# EAGLE design fpga (EAGLE 6.4)
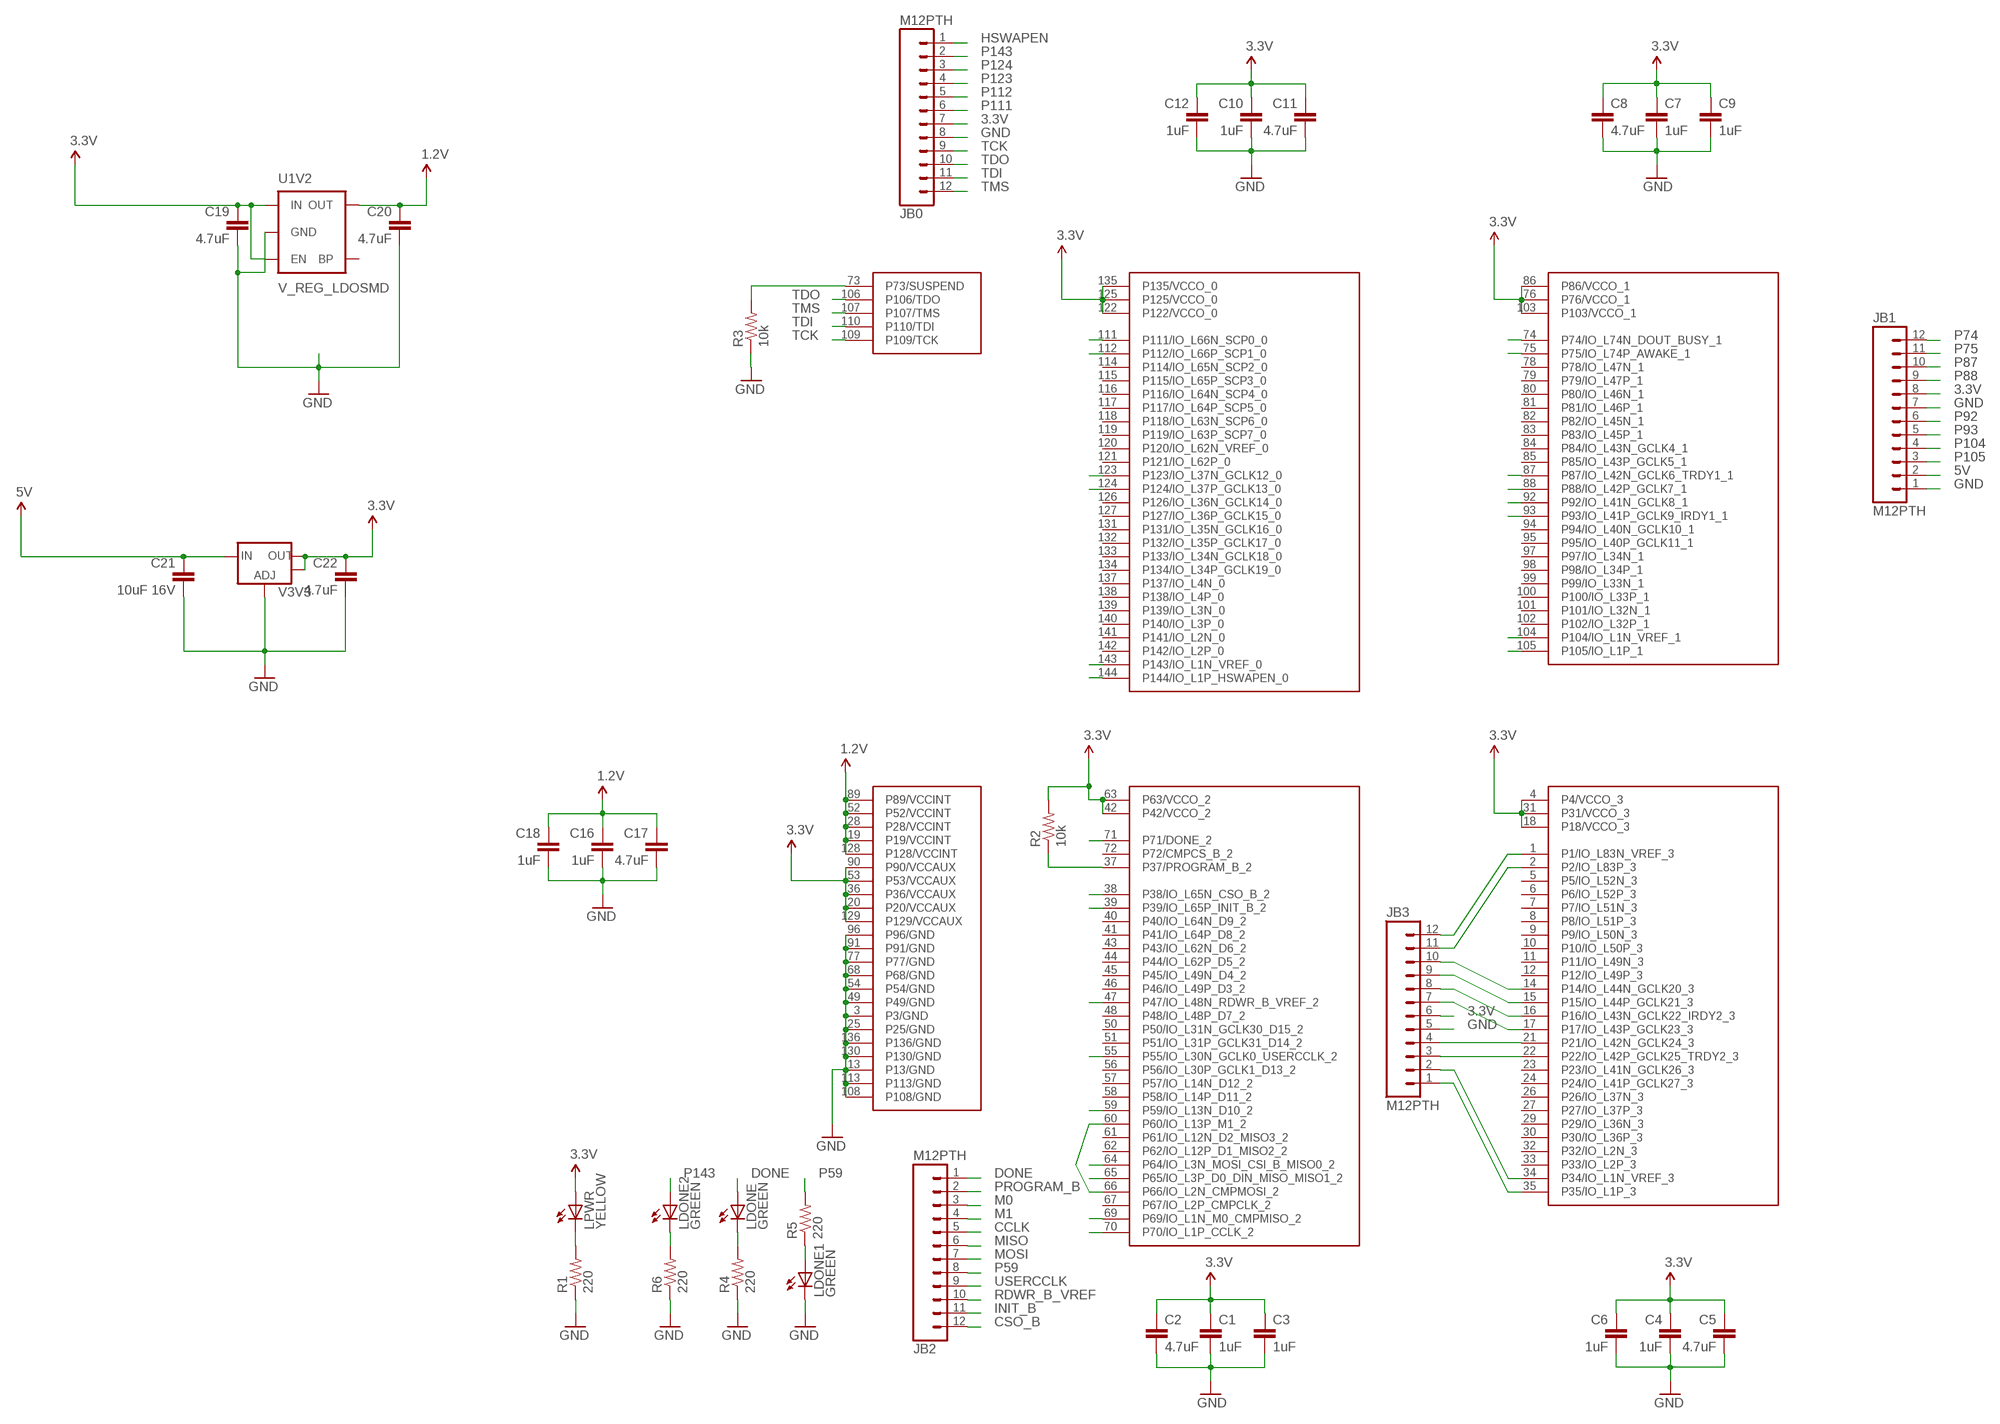
[diagram p0: schematic, sheet 1]

## Parts
C1  1uF  CAP0402-CAP  [0402-CAP]
C2  4.7uF  CAP0805  [0805]
C3  1uF  CAP0402-CAP  [0402-CAP]
C4  1uF  CAP0402-CAP  [0402-CAP]
C5  4.7uF  CAP0805  [0805]
C6  1uF  CAP0402-CAP  [0402-CAP]
C7  1uF  CAP0402-CAP  [0402-CAP]
C8  4.7uF  CAP0805  [0805]
C9  1uF  CAP0402-CAP  [0402-CAP]
C10  1uF  CAP0402-CAP  [0402-CAP]
C11  4.7uF  CAP0805  [0805]
C12  1uF  CAP0402-CAP  [0402-CAP]
C16  1uF  CAP0402-CAP  [0402-CAP]
C17  4.7uF  CAP0805  [0805]
C18  1uF  CAP0402-CAP  [0402-CAP]
C19  4.7uF  CAP0805  [0805]
C20  4.7uF  CAP0805  [0805]
C21  10uF 16V  CAP0805  [0805]
C22  4.7uF  CAP0805  [0805]
JB0  M12PTH  [1X12]
JB1  M12PTH  [1X12]
JB2  M12PTH  [1X12]
JB3  M12PTH  [1X12]
LDONE  GREEN  LED0603  [0603_LED]
LDONE1  GREEN  LED0603  [0603_LED]
LDONE2  GREEN  LED0603  [0603_LED]
LPWR  YELLOW  LED0603  [0603_LED]
R1  220  RESISTOR0603  [0603-RES]
R2  10k  RESISTOR0603  [0603-RES]
R3  10k  RESISTOR0603  [0603-RES]
R4  220  RESISTOR0603  [0603-RES]
R5  220  RESISTOR0603  [0603-RES]
R6  220  RESISTOR0603  [0603-RES]
U1V2  V_REG_LDOSMD  [SOT23-5]
U$1  XC6SLX-TQ144  [XILNX_TQ144]
V3V3  V_REG_LM1117SOT223  [SOT223]

## Nets
1.2V: C16.1 C17.1 C18.1 C20.1 U1V2.5(OUT) U$1.19(P19/VCCINT) U$1.28(P28/VCCINT) U$1.52(P52/VCCINT) U$1.89(P89/VCCINT) U$1.128(P128/VCCINT)
3.3V: C1.1 C2.1 C3.1 C4.1 C5.1 C6.1 C7.1 C8.1 C9.1 C10.1 C11.1 C12.1 C19.1 C22.1 JB0.7 JB1.8 JB3.6 LPWR.A R2.2 U1V2.1(IN) U1V2.3(EN) U$1.4(P4/VCCO_3) U$1.18(P18/VCCO_3) U$1.20(P20/VCCAUX) U$1.31(P31/VCCO_3) U$1.36(P36/VCCAUX) U$1.42(P42/VCCO_2) U$1.53(P53/VCCAUX) U$1.63(P63/VCCO_2) U$1.76(P76/VCCO_1) U$1.86(P86/VCCO_1) U$1.90(P90/VCCAUX) U$1.103(P103/VCCO_1) U$1.122(P122/VCCO_0) U$1.125(P125/VCCO_0) U$1.129(P129/VCCAUX) U$1.135(P135/VCCO_0) V3V3.2(OUT) V3V3.4(OUT)
5V: C21.1 JB1.2 V3V3.3(IN)
CCLK: JB2.5 U$1.70(P70/IO_L1P_CCLK_2)
CSO_B: JB2.12 U$1.38(P38/IO_L65N_CSO_B_2)
DONE: JB2.1 LDONE.A U$1.71(P71/DONE_2)
GND: C1.2 C2.2 C3.2 C4.2 C5.2 C6.2 C7.2 C8.2 C9.2 C10.2 C11.2 C12.2 C16.2 C17.2 C18.2 C19.2 C20.2 C21.2 C22.2 JB0.8 JB1.1 JB1.7 JB3.5 LDONE1.C R1.1 R3.1 R4.1 R6.1 U1V2.2(GND) U$1.3(P3/GND) U$1.13(P13/GND) U$1.25(P25/GND) U$1.49(P49/GND) U$1.54(P54/GND) U$1.68(P68/GND) U$1.77(P77/GND) U$1.91(P91/GND) U$1.96(P96/GND) U$1.108(P108/GND) U$1.113(P113/GND) U$1.130(P130/GND) U$1.136(P136/GND) V3V3.1(ADJ)
HSWAPEN: JB0.1 U$1.144(P144/IO_L1P_HSWAPEN_0)
INIT_B: JB2.11 U$1.39(P39/IO_L65P_INIT_B_2)
M0: JB2.3 U$1.69(P69/IO_L1N_M0_CMPMISO_2)
M1: JB2.4 U$1.60(P60/IO_L13P_M1_2) U$1.66(P66/IO_L2N_CMPMOSI_2)
MISO: JB2.6 U$1.65(P65/IO_L3P_D0_DIN_MISO_MISO1_2)
MOSI: JB2.7 U$1.64(P64/IO_L3N_MOSI_CSI_B_MISO0_2)
N$1: LDONE1.A R5.1
N$2: LPWR.C R1.2
N$3: LDONE.C R4.2
N$4: LDONE2.C R6.2
N$8: R3.2 U$1.73(P73/SUSPEND)
P1: JB3.12 U$1.1(P1/IO_L83N_VREF_3)
P2: JB3.11 U$1.2(P2/IO_L83P_3)
P14: JB3.10 U$1.14(P14/IO_L44N_GCLK20_3)
P15: JB3.9 U$1.15(P15/IO_L44P_GCLK21_3)
P16: JB3.8 U$1.16(P16/IO_L43N_GCLK22_IRDY2_3)
P17: JB3.7 U$1.17(P17/IO_L43P_GCLK23_3)
P21: JB3.4 U$1.21(P21/IO_L42N_GCLK24_3)
P22: JB3.3 U$1.22(P22/IO_L42P_GCLK25_TRDY2_3)
P34: JB3.2 U$1.34(P34/IO_L1N_VREF_3)
P35: JB3.1 U$1.35(P35/IO_L1P_3)
P59: JB2.8 R5.2 U$1.59(P59/IO_L13N_D10_2)
P74: JB1.12 U$1.74(P74/IO_L74N_DOUT_BUSY_1)
P75: JB1.11 U$1.75(P75/IO_L74P_AWAKE_1)
P87: JB1.10 U$1.87(P87/IO_L42N_GCLK6_TRDY1_1)
P88: JB1.9 U$1.88(P88/IO_L42P_GCLK7_1)
P92: JB1.6 U$1.92(P92/IO_L41N_GCLK8_1)
P93: JB1.5 U$1.93(P93/IO_L41P_GCLK9_IRDY1_1)
P104: JB1.4 U$1.104(P104/IO_L1N_VREF_1)
P105: JB1.3 U$1.105(P105/IO_L1P_1)
P111: JB0.6 U$1.111(P111/IO_L66N_SCP0_0)
P112: JB0.5 U$1.112(P112/IO_L66P_SCP1_0)
P123: JB0.4 U$1.123(P123/IO_L37N_GCLK12_0)
P124: JB0.3 U$1.124(P124/IO_L37P_GCLK13_0)
P143: JB0.2 LDONE2.A U$1.143(P143/IO_L1N_VREF_0)
PROGRAM_B: JB2.2 R2.1 U$1.37(P37/PROGRAM_B_2)
RDWR_B_VREF: JB2.10 U$1.47(P47/IO_L48N_RDWR_B_VREF_2)
TCK: JB0.9 U$1.109(P109/TCK)
TDI: JB0.11 U$1.110(P110/TDI)
TDO: JB0.10 U$1.106(P106/TDO)
TMS: JB0.12 U$1.107(P107/TMS)
USERCCLK: JB2.9 U$1.55(P55/IO_L30N_GCLK0_USERCCLK_2)
Unconnected: U1V2.4(BP) U$1.5(P5/IO_L52N_3) U$1.6(P6/IO_L52P_3) U$1.7(P7/IO_L51N_3) U$1.8(P8/IO_L51P_3) U$1.9(P9/IO_L50N_3) U$1.10(P10/IO_L50P_3) U$1.11(P11/IO_L49N_3) U$1.12(P12/IO_L49P_3) U$1.23(P23/IO_L41N_GCLK26_3) U$1.24(P24/IO_L41P_GCLK27_3) U$1.26(P26/IO_L37N_3) U$1.27(P27/IO_L37P_3) U$1.29(P29/IO_L36N_3) U$1.30(P30/IO_L36P_3) U$1.32(P32/IO_L2N_3) U$1.33(P33/IO_L2P_3) U$1.40(P40/IO_L64N_D9_2) U$1.41(P41/IO_L64P_D8_2) U$1.43(P43/IO_L62N_D6_2) U$1.44(P44/IO_L62P_D5_2) U$1.45(P45/IO_L49N_D4_2) U$1.46(P46/IO_L49P_D3_2) U$1.48(P48/IO_L48P_D7_2) U$1.50(P50/IO_L31N_GCLK30_D15_2) U$1.51(P51/IO_L31P_GCLK31_D14_2) U$1.56(P56/IO_L30P_GCLK1_D13_2) U$1.57(P57/IO_L14N_D12_2) U$1.58(P58/IO_L14P_D11_2) U$1.61(P61/IO_L12N_D2_MISO3_2) U$1.62(P62/IO_L12P_D1_MISO2_2) U$1.67(P67/IO_L2P_CMPCLK_2) U$1.72(P72/CMPCS_B_2) U$1.78(P78/IO_L47N_1) U$1.79(P79/IO_L47P_1) U$1.80(P80/IO_L46N_1) U$1.81(P81/IO_L46P_1) U$1.82(P82/IO_L45N_1) U$1.83(P83/IO_L45P_1) U$1.84(P84/IO_L43N_GCLK4_1) U$1.85(P85/IO_L43P_GCLK5_1) U$1.94(P94/IO_L40N_GCLK10_1) U$1.95(P95/IO_L40P_GCLK11_1) U$1.97(P97/IO_L34N_1) U$1.98(P98/IO_L34P_1) U$1.99(P99/IO_L33N_1) U$1.100(P100/IO_L33P_1) U$1.101(P101/IO_L32N_1) U$1.102(P102/IO_L32P_1) U$1.114(P114/IO_L65N_SCP2_0) U$1.115(P115/IO_L65P_SCP3_0) U$1.116(P116/IO_L64N_SCP4_0) U$1.117(P117/IO_L64P_SCP5_0) U$1.118(P118/IO_L63N_SCP6_0) U$1.119(P119/IO_L63P_SCP7_0) U$1.120(P120/IO_L62N_VREF_0) U$1.121(P121/IO_L62P_0) U$1.126(P126/IO_L36N_GCLK14_0) U$1.127(P127/IO_L36P_GCLK15_0) U$1.131(P131/IO_L35N_GCLK16_0) U$1.132(P132/IO_L35P_GCLK17_0) U$1.133(P133/IO_L34N_GCLK18_0) U$1.134(P134/IO_L34P_GCLK19_0) U$1.137(P137/IO_L4N_0) U$1.138(P138/IO_L4P_0) U$1.139(P139/IO_L3N_0) U$1.140(P140/IO_L3P_0) U$1.141(P141/IO_L2N_0) U$1.142(P142/IO_L2P_0)

## Library data of the parts
C1 C3 C4 C6 C7 C9 C10 C12 C16 C18 = SparkFun-Capacitors:CAP: Capacitor Standard 0603 ceramic capacitor, and 0.1" leaded capacitor.
C2 C5 C8 C11 C17 C19-C22 = kmod:CAP: Capacitor Standard 0603 ceramic capacitor, and 0.1" leaded capacitor.
JB0 JB1-JB3 = SparkFun-Connectors:M12: Header 12 Standard 12-pin 0.1" header. Use with straight break away headers (SKU : PRT-00116), right angle break away headers (PRT-00553), swiss pins (PRT-00743), machine pins (PRT-00117), and female headers (PRT-00115).
LDONE LDONE1 LDONE2 LPWR = kmod:LED
R1-R6 = kmod:RESISTOR: Resistor Basic schematic elements and footprints for 0603, 1206, and PTH resistors.
U1V2 = SparkFun-PowerIC:V_REG_LDO: Voltage Regulator LDO Standard 150mA LDO voltage regulator in SOT-23 layout. Micrel part MIC5205. BP (by-pass) pin is used to lower output noise with 470pF cap.
U$1 = kmod:XC6SLX-TQ144: Spartan-6 in 144-TQFP package
V3V3 = SparkFun-PowerIC:V_REG_LM1117: Voltage Regulator LM1117 Standard adjustable voltage regulator but in SMD form. Spark Fun Electronics SKU : COM-00595

## Board
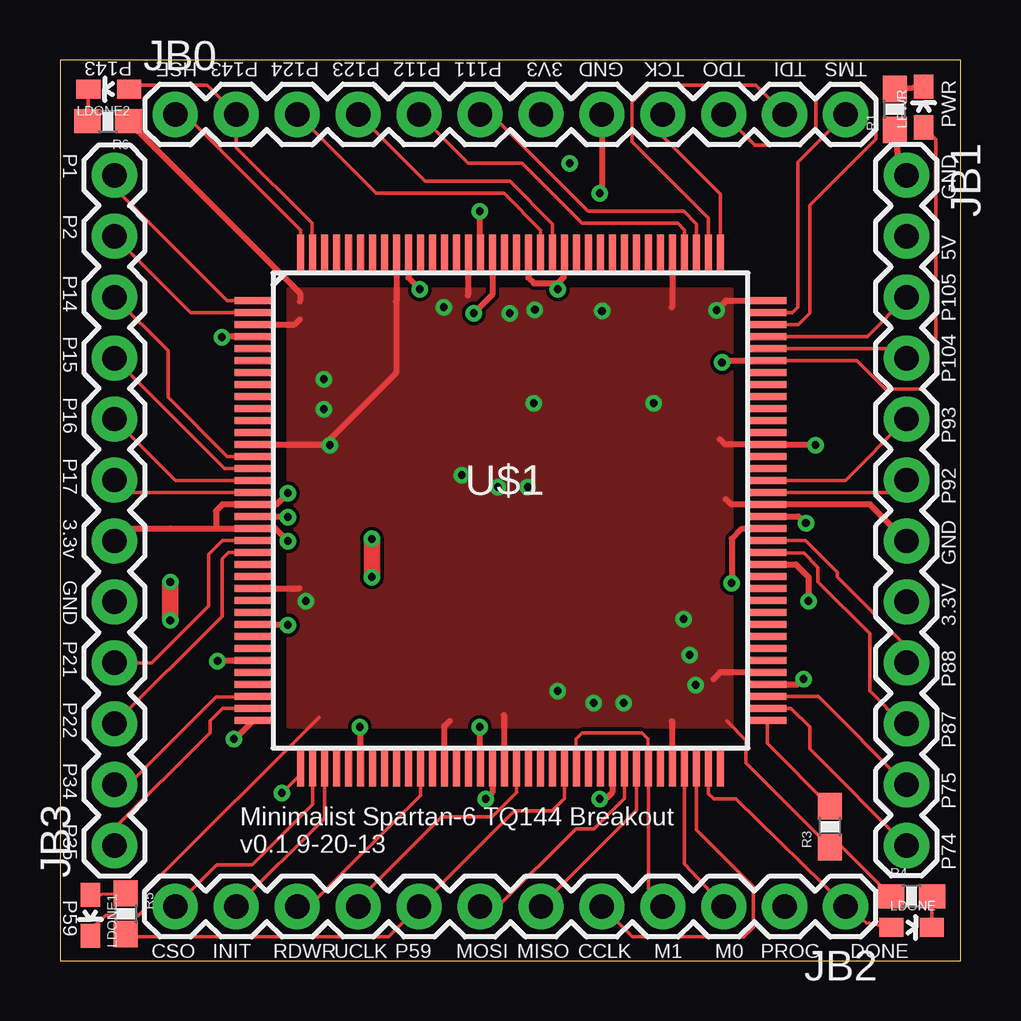
[diagram p1: board, top side]
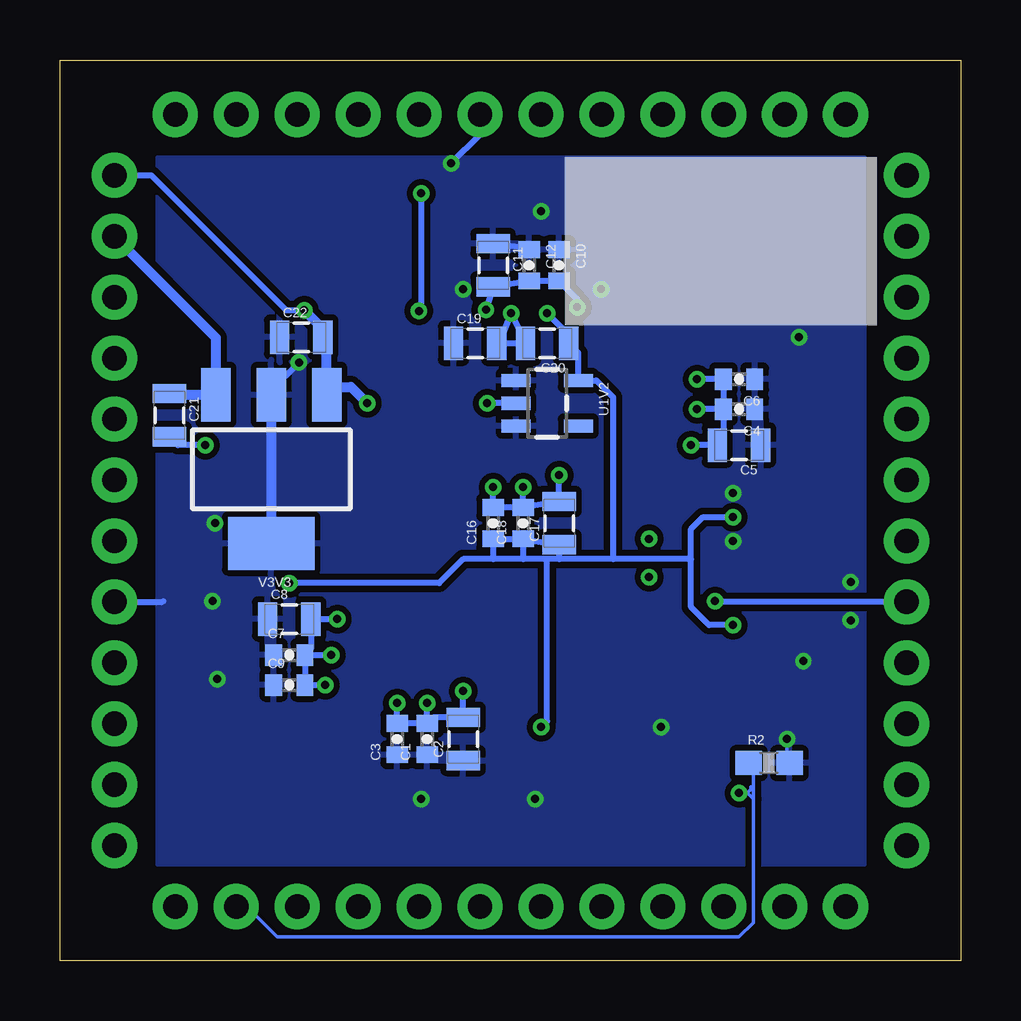
[diagram p2: board, bottom side, seen from below]

Size 37.56 x 37.56 mm. Coordinates in mm from the lower left corner, seen from the top.
Outline: 0,0 37.56,0 37.56,37.56 0,37.56 0,0
Copper layers (1*16): Top 0.0356mm / dielectric 1.5011mm / Bottom 0.0356mm
Design rules "OSHPark_mine": minimum track width 6mil, minimum drill 13mil, track to track 6mil, track to pad 6mil, pad to pad 6mil, via to via 6mil, smd to smd 6mil, copper to edge 15mil, drill to drill 6mil, minimum pad ring 7mil, minimum via ring 7mil, stop-mask expansion 2mil, vias tented up to drill 13mil, thermal gap 10mil

### Footprints (pad centres in the part's own frame; a part is rotated, then mirrored left to right if it is on the bottom)
0402-CAP = smd 0.7 x 0.9: 1 -0.65,0; 2 0.65,0
0805 = smd 0.8 x 1.4: 1 -0.9,0; 2 0.9,0
1X12 = drill 1.016 pad 1.88: 1 0,0; 2 2.54,0; 3 5.08,0; 4 7.62,0; 5 10.16,0; 6 12.7,0; 7 15.24,0; 8 17.78,0; 9 20.32,0; 10 22.86,0; 11 25.4,0; 12 27.94,0
0603_LED = smd 0.8 x 1.003: A 0,-0.852; C 0,0.852
0603-RES = smd 1.1 x 1: 1 -0.85,0; 2 0.85,0
SOT23-5 = smd 0.55 x 1.2: 1 -0.95,-1.3; 2 0,-1.3; 3 0.95,-1.3; 4 0.95,1.3; 5 -0.95,1.3
XILNX_TQ144 = smd 1.6 x 0.3: 1 -10.7,8.75; 2 -10.7,8.25; 3 -10.7,7.75; 4 -10.7,7.25; 5 -10.7,6.75; 6 -10.7,6.25; 7 -10.7,5.75; 8 -10.7,5.25; 9 -10.7,4.75; 10 -10.7,4.25; 11 -10.7,3.75; 12 -10.7,3.25; 13 -10.7,2.75; 14 -10.7,2.25; 15 -10.7,1.75; 16 -10.7,1.25; 17 -10.7,0.75; 18 -10.7,0.25; 19 -10.7,-0.25; 20 -10.7,-0.75; 21 -10.7,-1.25; 22 -10.7,-1.75; 23 -10.7,-2.25; 24 -10.7,-2.75; 25 -10.7,-3.25; 26 -10.7,-3.75; 27 -10.7,-4.25; 28 -10.7,-4.75; 29 -10.7,-5.25; 30 -10.7,-5.75; 31 -10.7,-6.25; 32 -10.7,-6.75; 33 -10.7,-7.25; 34 -10.7,-7.75; 35 -10.7,-8.25; 36 -10.7,-8.75; 73 10.7,-8.75; 74 10.7,-8.25; 75 10.7,-7.75; 76 10.7,-7.25; 77 10.7,-6.75; 78 10.7,-6.25; 79 10.7,-5.75; 80 10.7,-5.25; 81 10.7,-4.75; 82 10.7,-4.25; 83 10.7,-3.75; 84 10.7,-3.25; 85 10.7,-2.75; 86 10.7,-2.25; 87 10.7,-1.75; 88 10.7,-1.25; 89 10.7,-0.75; 90 10.7,-0.25; 91 10.7,0.25; 92 10.7,0.75; 93 10.7,1.25; 94 10.7,1.75; 95 10.7,2.25; 96 10.7,2.75; 97 10.7,3.25; 98 10.7,3.75; 99 10.7,4.25; 100 10.7,4.75; 101 10.7,5.25; 102 10.7,5.75; 103 10.7,6.25; 104 10.7,6.75; 105 10.7,7.25; 106 10.7,7.75; 107 10.7,8.25; 108 10.7,8.75 | smd 0.3 x 1.6: 37 -8.75,-10.7; 38 -8.25,-10.7; 39 -7.75,-10.7; 40 -7.25,-10.7; 41 -6.75,-10.7; 42 -6.25,-10.7; 43 -5.75,-10.7; 44 -5.25,-10.7; 45 -4.75,-10.7; 46 -4.25,-10.7; 47 -3.75,-10.7; 48 -3.25,-10.7; 49 -2.75,-10.7; 50 -2.25,-10.7; 51 -1.75,-10.7; 52 -1.25,-10.7; 53 -0.75,-10.7; 54 -0.25,-10.7; 55 0.25,-10.7; 56 0.75,-10.7; 57 1.25,-10.7; 58 1.75,-10.7; 59 2.25,-10.7; 60 2.75,-10.7; 61 3.25,-10.7; 62 3.75,-10.7; 63 4.25,-10.7; 64 4.75,-10.7; 65 5.25,-10.7; 66 5.75,-10.7; 67 6.25,-10.7; 68 6.75,-10.7; 69 7.25,-10.7; 70 7.75,-10.7; 71 8.25,-10.7; 72 8.75,-10.7; 109 8.75,10.7; 110 8.25,10.7; 111 7.75,10.7; 112 7.25,10.7; 113 6.75,10.7; 114 6.25,10.7; 115 5.75,10.7; 116 5.25,10.7; 117 4.75,10.7; 118 4.25,10.7; 119 3.75,10.7; 120 3.25,10.7; 121 2.75,10.7; 122 2.25,10.7; 123 1.75,10.7; 124 1.25,10.7; 125 0.75,10.7; 126 0.25,10.7; 127 -0.25,10.7; 128 -0.75,10.7; 129 -1.25,10.7; 130 -1.75,10.7; 131 -2.25,10.7; 132 -2.75,10.7; 133 -3.25,10.7; 134 -3.75,10.7; 135 -4.25,10.7; 136 -4.75,10.7; 137 -5.25,10.7; 138 -5.75,10.7; 139 -6.25,10.7; 140 -6.75,10.7; 141 -7.25,10.7; 142 -7.75,10.7; 143 -8.25,10.7; 144 -8.75,10.7
SOT223 = smd 1.219 x 2.235: 1 -2.311,-3.099; 2 0,-3.099; 3 2.311,-3.099 | smd 3.6 x 2.2: 4 0,3.099

### Placement (x,y rotation side)
C1  22.25,9.25 90 bottom
C2  20.75,9.25 90 bottom
C3  23.5,9.25 90 bottom
C4  9.25,23 180 bottom
C5  9.25,21.5 180 bottom
C6  9.25,24.25 180 bottom
C7  28,12.75 0 bottom
C8  28,14.25 0 bottom
C9  28,11.5 0 bottom
C10  16.75,29 270 bottom
C11  19.5,29 270 bottom
C12  18,29 270 bottom
C16  19.5,18.25 90 bottom
C17  16.75,18.25 90 bottom
C18  18.25,18.25 90 bottom
C19  20.25,25.75 0 bottom
C20  17.25,25.75 180 bottom
C21  33,22.75 270 bottom
C22  27.5,26 0 bottom
JB0  4.81,35.29 0 top
JB1  35.29,32.75 270 top
JB2  32.75,2.27 180 top
JB3  2.27,4.81 90 top
LDONE  35.5,1.4 270 top
LDONE1  1.27,1.91 180 top
LDONE2  2.04,36.34 90 top
LPWR  36,35.6 0 top
R1  34.8,35.5 90 top
R2  8,8.25 0 bottom
R3  32.1,5.6 90 top
R4  35.5,2.7 0 top
R5  2.74,1.97 270 top
R6  2,35 180 top
U1V2  17.25,23.25 270 bottom
U$1  18.78,18.78 0 top
V3V3  28.75,20.5 180 bottom

### Tracks (layer width: path | path; a pad name or v marks a point on that pad's centre or on a via)
1.2V  (via drill 0.33)
  Top 0.254: U$1.28 9.47,14.03 v9.5,14 | U$1.19 9.47,18.53 v9.5,18.5 | U$1.89 29.51,18 28.4,18 28,17.6 v28,15.75 | U$1.52 17.5,8.11 v17.5,9.75 | U$1.128 18.03,27.78 v17.25,27
  Bottom 0.254: v9.5,14 10.5,14 11.25,14.75 11.25,16.75 | 11.25,16.75 11.25,18 10.75,18.5 v9.5,18.5 | 11.25,16.75 14.5,16.75 | 14.5,16.75 16.75,16.75 | 16.75,16.75 17.25,16.75 | 17.25,16.75 18.25,16.75 | 18.25,16.75 19.5,16.75 | 19.5,16.75 20.75,16.75 21.75,15.75 v28,15.75 | v17.5,9.75 17.25,10 17.25,16.75 | C18.1 C16.1 19.5,16.75 | C18.1 C17.1 16.75,16.75 | C18.1 18.25,16.75 | 14.5,16.75 14.5,23.5 15.2,24.2 U1V2.5 15.95,25.35 C20.1 16.35,26.1 v17.25,27
3.3V  (via drill 0.33)
  Top 0.152: 7.3,9.25 v7.25,9.25 | U$1.103 33.22,25.03 34.4,23.85 35.9,23.85 36.5,24.45 36.5,34.25 LPWR.A | 4.6,18.03
  Top 0.254: JB3.6 2.79,18.03 4.6,18.03 6.5,18.03 | 6.5,18.03 U$1.20 8.97,18.03 v9.5,17.5 | 6.5,18.03 6.5,18.75 6.78,19.03 U$1.18 9.03,19.03 v9.5,19.5 | U$1.31 8.11,12.5 v6.57,12.5 | U$1.42 12.53,9.72 v12.5,9.75 | 29.45,18.5 U$1.90 30.78,18.53 v31.1,18.25 | 20.75,28.25 19.75,28.25 19.53,28.47 U$1.125 | 20.75,28.25 21,28.5 21,29.45 U$1.122 | U$1.36 7.3,9.25 | v27.6,24.95 27.68,25.03 U$1.103 | U$1.53 18.03,7.03 v17.75,6.75 | U$1.63 23.03,7.03 22.75,6.75 v22.5,6.75 | 20.75,28.25 v20.75,28 | U$1.135 14.53,28.47 v15,28 | U$1.4 6.78,26.03 v6.75,26 | U$1.129 17.5,29.51 v17.5,31.25 | U$1.76 30.78,11.53 v31,11.75 | U$1.86 30.67,16.53 31.2,16 v31.2,15
  Top 0.686: v4.6,15.8 v4.6,14.2
  Bottom 0.152: R2.2 7.25,8.35 v7.25,9.25
  Bottom 0.254: V3V3.2 28.75,23.8 v27.6,24.95 | C11.1 18.25,29.75 | JB0.7 20.05,34.45 v21.25,33.25 | JB1.8 33.28,14.97 33.25,15
  Bottom 0.406: V3V3.2 V3V3.4
  pour Bottom (isolate 0.254): 4,33.5 33.5,33.5 33.5,4 4,4
3.3V1  (via drill 0.33)
  Top 0.686: v13,17.6 v13,16
5V
  Bottom 0.406: JB1.2 31.06,25.98 V3V3.3 32.95,23.6 C21.1
CCLK
  Top 0.152: U$1.70 26.53,5.47 28.9,3.1 28.9,1.4 28.5,1 23.86,1 JB2.5
CSO_B
  Top 0.152: U$1.38 10.53,6.53 8,4 6.54,4 JB2.12
DONE
  Top 0.152: U$1.71 27.03,6.97 27.25,6.75 28.17,6.75 JB2.1 33.62,1.6 LDONE.A
GND  (via drill 0.33)
  Top 0.152: LDONE1.C 1.27,1.27 1.91,1.91 3.29,1.91 3.56,2.18 3.56,2.98 3.86,3.28 3.92,3.28 10.79,10.16 | R4.1 32.6,4.75 R3.1 28.6,8.25 28.6,9.2 27.8,10
  Top 0.254: U$1.25 9.97,15.53 | U$1.136 14.03,27.53 14,27.5 14,24.5 11,21.5 8.11,21.5 U$1.13 | U$1.113 25.53,27.28 25.5,27.25 | 27.78,27.53 27.75,27.5 | 27.75,27.5 v27.38,27.12 27.25,27 | 27.5,21.75 27.72,21.53 U$1.96 31.47,21.53 v31.5,21.5 | 27.75,19.25 27.97,19.03 U$1.91 33.77,19.03 JB1.7 | 29.5,27.55 U$1.108 29.45,27.5 27.75,27.5 | JB1.1 35,33.04 R1.1 | R6.1 10,27.85 10,27.5 | U$1.3 9.78,26.53 10,26.75 | U$1.54 18.53,10.22 18.5,10.25 | U$1.49 16.03,9.78 16.25,10 | U$1.68 25.53,9.97 25.5,10 | U$1.77 27.53,12.03 27.25,11.75 | JB0.8 22.59,31.84 v22.5,32 | U$1.130 17,29.45 17,27.75
  Bottom 0.152: 26.44,26.19 26.44,26.16 C22.2
  Bottom 0.254: 22.59,27.26 22.6,27.25 v22.6,27.1 22.5,27.2 v22.5,32 | JB1.1 33.75,32.75 28.12,27.12 v27.38,27.12 | JB3.5 10.22,14.97 v10.25,15 | v31.5,21.5 32.65,21.5 C21.2 | U1V2.2 v19.75,23.25 | C18.2 C17.2 v16.75,20.25 | C18.2 C16.2 v19.5,19.75 | C19.2 19.25,25.75 | 19.25,25.75 C20.2 v18.75,27 19.25,25.75 | v19.8,27.15 C11.2 C12.2 C10.2 16,27.6 v16,27.25 | C7.2 27.1,13 C8.2 v26,14.25 | C7.2 C9.2 v26.5,11.5 | C7.2 v26.25,12.75 | C4.2 C6.2 v11,24.25 | C4.2 9.9,21.75 C5.2 v11.25,21.5 | C4.2 v11,23 | C18.2 v18.25,19.75 | C1.2 22,10.15 C2.2 v20.75,11.25 | C1.2 C3.2 v23.5,10.75 | C1.2 v22.25,10.75
  Bottom 0.406: V3V3.1 26.44,23.93 | 26.44,23.93 26.44,26.19 v27.38,27.12 | 26.44,23.93 25.43,23.93 v24.75,23.25
  pour Top: 9.5,28 28,28 28,9.75 9.5,9.75
HSWAPEN
  Top 0.152: U$1.144 10.03,30.47 5.31,35.19 JB0.1
INIT_B
  Top 0.152: JB2.11 11.03,5.95 U$1.39
M0
  Top 0.152: U$1.69 26.03,4.04 JB2.3
M1
  Top 0.152: JB2.4 24.53,3 U$1.66 24.5,8.11 24.5,9.25 24.25,9.5 21.75,9.5 21.5,9.25 21.5,8.11 U$1.60
MISO
  Top 0.152: U$1.65 24.03,6.28 20.05,2.3 JB2.6
MOSI
  Top 0.152: U$1.64 23.53,6.78 22.25,5.5 21.5,5.5 18.27,2.27 JB2.7
N$1
  Top 0.152: LDONE1.A R5.1
N$2
  Top 0.254: R1.2 LPWR.C
N$3
  Top 0.152: R4.2 LDONE.C
N$4
  Top 0.152: LDONE2.C R6.2
N$8
  Top 0.152: R3.2 29.48,9.07 U$1.73
P1
  Top 0.152: U$1.1 6.97,27.53 2.27,32.23 JB3.12
P2
  Top 0.152: U$1.2 5.45,27.03 JB3.11
P14
  Top 0.152: U$1.14 6.97,21.03 4.5,23.5 4.5,25.44 JB3.10
P15
  Top 0.152: U$1.15 6.87,20.53 JB3.9
P16
  Top 0.152: U$1.16 4.83,20.03 JB3.8
P17
  Top 0.152: U$1.17 2.79,19.53 JB3.7
P21
  Top 0.152: U$1.21 6.78,17.53 6.2,16.95 6.2,14.8 3.83,12.43 JB3.4
P22
  Top 0.152: U$1.22 7.03,17.03 6.75,16.75 6.75,14.37 JB3.3
P34
  Top 0.152: U$1.34 8.05,11 6.5,11 2.85,7.35 JB3.2
P35
  Top 0.152: U$1.35 6.78,10.53 6.25,10 6.25,9.5 2.27,5.52 JB3.1
P59
  Top 0.152: U$1.59 21.03,6.78 20.5,6.25 18.95,6.25 JB2.8 13.7,1 2.65,1 R5.2
P74
  Top 0.152: JB1.12 31.25,8.85 31.25,9.75 30.47,10.53 U$1.74
P75
  Top 0.152: JB1.11 31.61,11.03 U$1.75
P87
  Top 0.152: U$1.87 29.51,17 31,17 31.6,16.4 31.6,15.8 33.75,13.65 33.75,11.25 35.11,9.89 JB1.10
P88
  Top 0.152: U$1.88 31.07,17.53 32.4,16.2 32.4,16 35.29,13.11 JB1.9
P92
  Top 0.152: U$1.92 34.77,19.53 JB1.6
P93
  Top 0.152: U$1.93 32.73,20.03 JB1.5
P104
  Top 0.152: U$1.104 34.89,25.53 JB1.4
P105
  Top 0.152: U$1.105 33.65,26.03 JB1.3
P111
  Top 0.152: U$1.111 26.53,30.72 26,31.25 22,31.25 17.96,35.29 JB0.6
P112
  Top 0.152: U$1.112 26.03,30.47 25.75,30.75 21.75,30.75 19.25,33.25 17.01,33.25 JB0.5
P123
  Top 0.152: U$1.123 20.53,30.72 18.75,32.5 15.22,32.5 JB0.4
P124
  Top 0.152: U$1.124 20.03,30.47 18.5,32 13.18,32 JB0.3
P143
  Top 0.152: U$1.143 10.5,29.51 10.5,30.75 7.35,33.9 JB0.2 6.14,36.5 3.05,36.5 LDONE2.A
PROGRAM_B  (via drill 0.33)
  Top 0.152: U$1.37 10.03,7.78 v9.25,7
  Bottom 0.152: JB2.2 29.77,2.27 28.5,1 9.25,1 8.65,1.6 8.65,6.75 | 8.65,6.75 8.65,8.05 R2.1 | v9.25,7 8.9,7 | 8.9,7 8.65,6.75 | 8.9,7 8.75,7.15 8.75,7.25
RDWR_B_VREF
  Top 0.152: U$1.47 15.03,6.91 10.39,2.27 JB2.10
TCK
  Top 0.152: U$1.109 27.53,31.97 25.13,34.37 JB0.9
TDI
  Top 0.152: U$1.110 27.03,30.97 23.85,34.15 23.85,35.8 24.55,36.5 29,36.5 JB0.11
TDO
  Top 0.152: U$1.106 30.78,26.53 31.25,27 31.25,31.5 34,34.25 34,36 33.5,36.5 32,36.5 31.5,36 31.5,34.75 30.75,34 28.96,34 JB0.10
TMS
  Top 0.152: U$1.107 30.53,27.03 30.75,27.25 30.75,33.29 JB0.12
USERCCLK
  Top 0.152: U$1.55 19.03,7.03 18,6 15.91,6 12.43,2.52 JB2.9

### Text on the board
tPlace: P143 | HSE | P143 | P124 | P123 | P112 | P111 | 3V3 | GND | TCK | TDO | TDI | TMS | PWR | P1 | GND | P2 | P14 | 5V | P105 | P15 | P104 | P16 | P93 | P17 | P92 | 3.3v | GND | GND | 3.3V | P21 | P22 | P88 | P87 | P34 | P35 | P75 | Minimalist Spartan-6 TQ144 Breakout / v0.1 9-20-13 | P74 | P59 | CSO | INIT | RDWR | UCLK | P59 | MOSI | MISO | CCLK | M1 | M0 | PROG | DONE